# EAGLE schematic board (EAGLE 6.4)
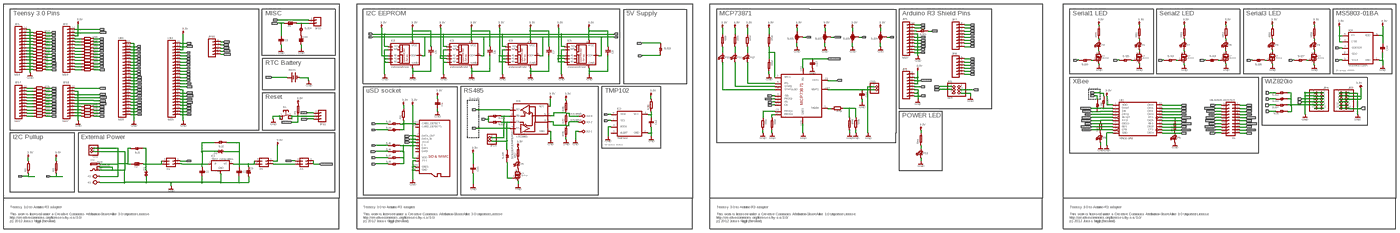
[diagram p0: schematic, sheet 1, overview]
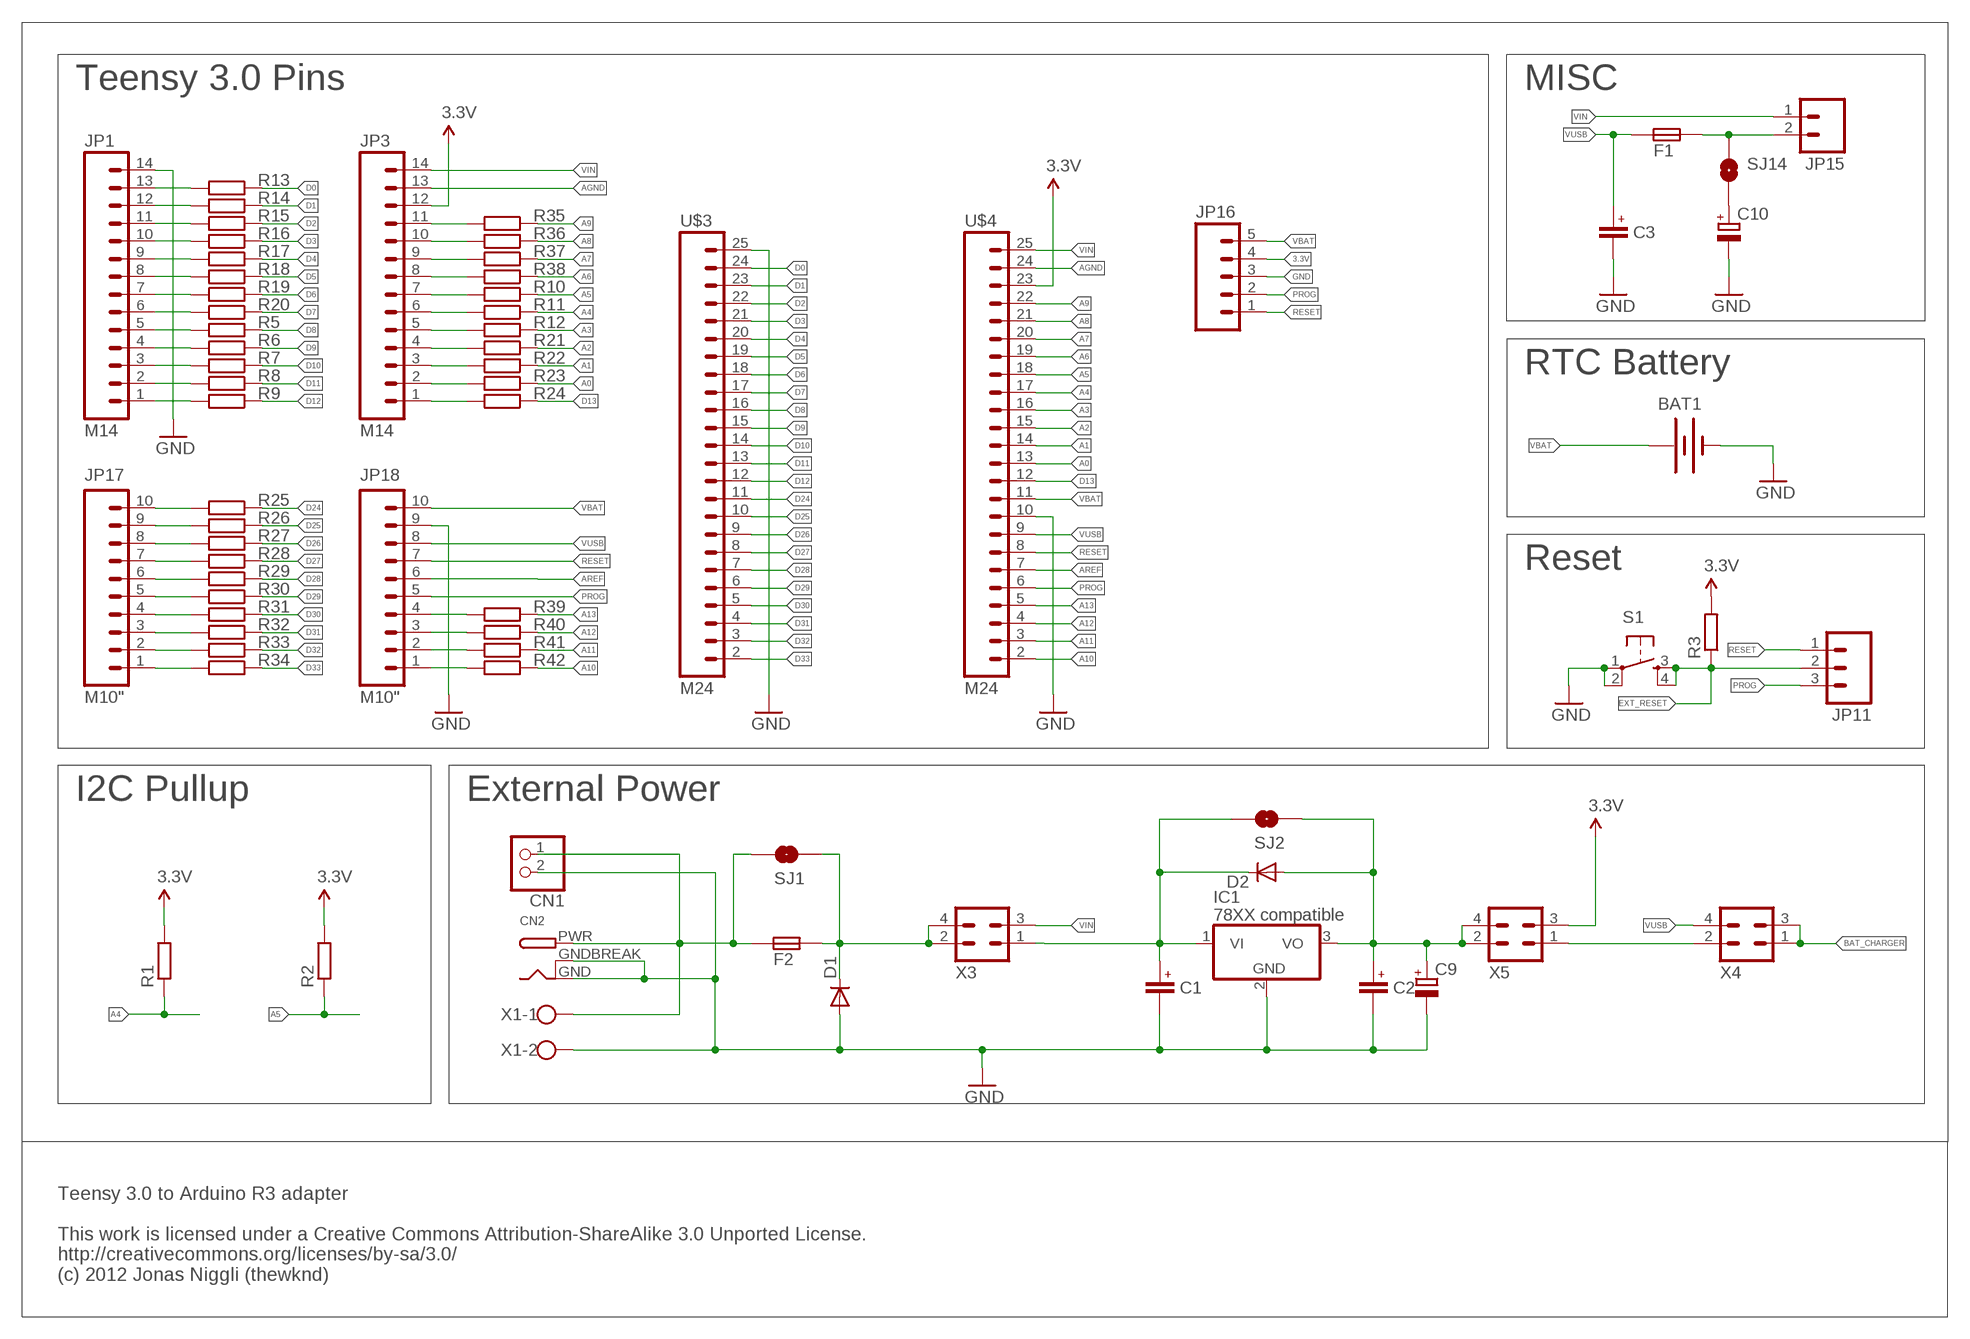
[diagram p1: schematic, sheet 1, part 1 of 4]
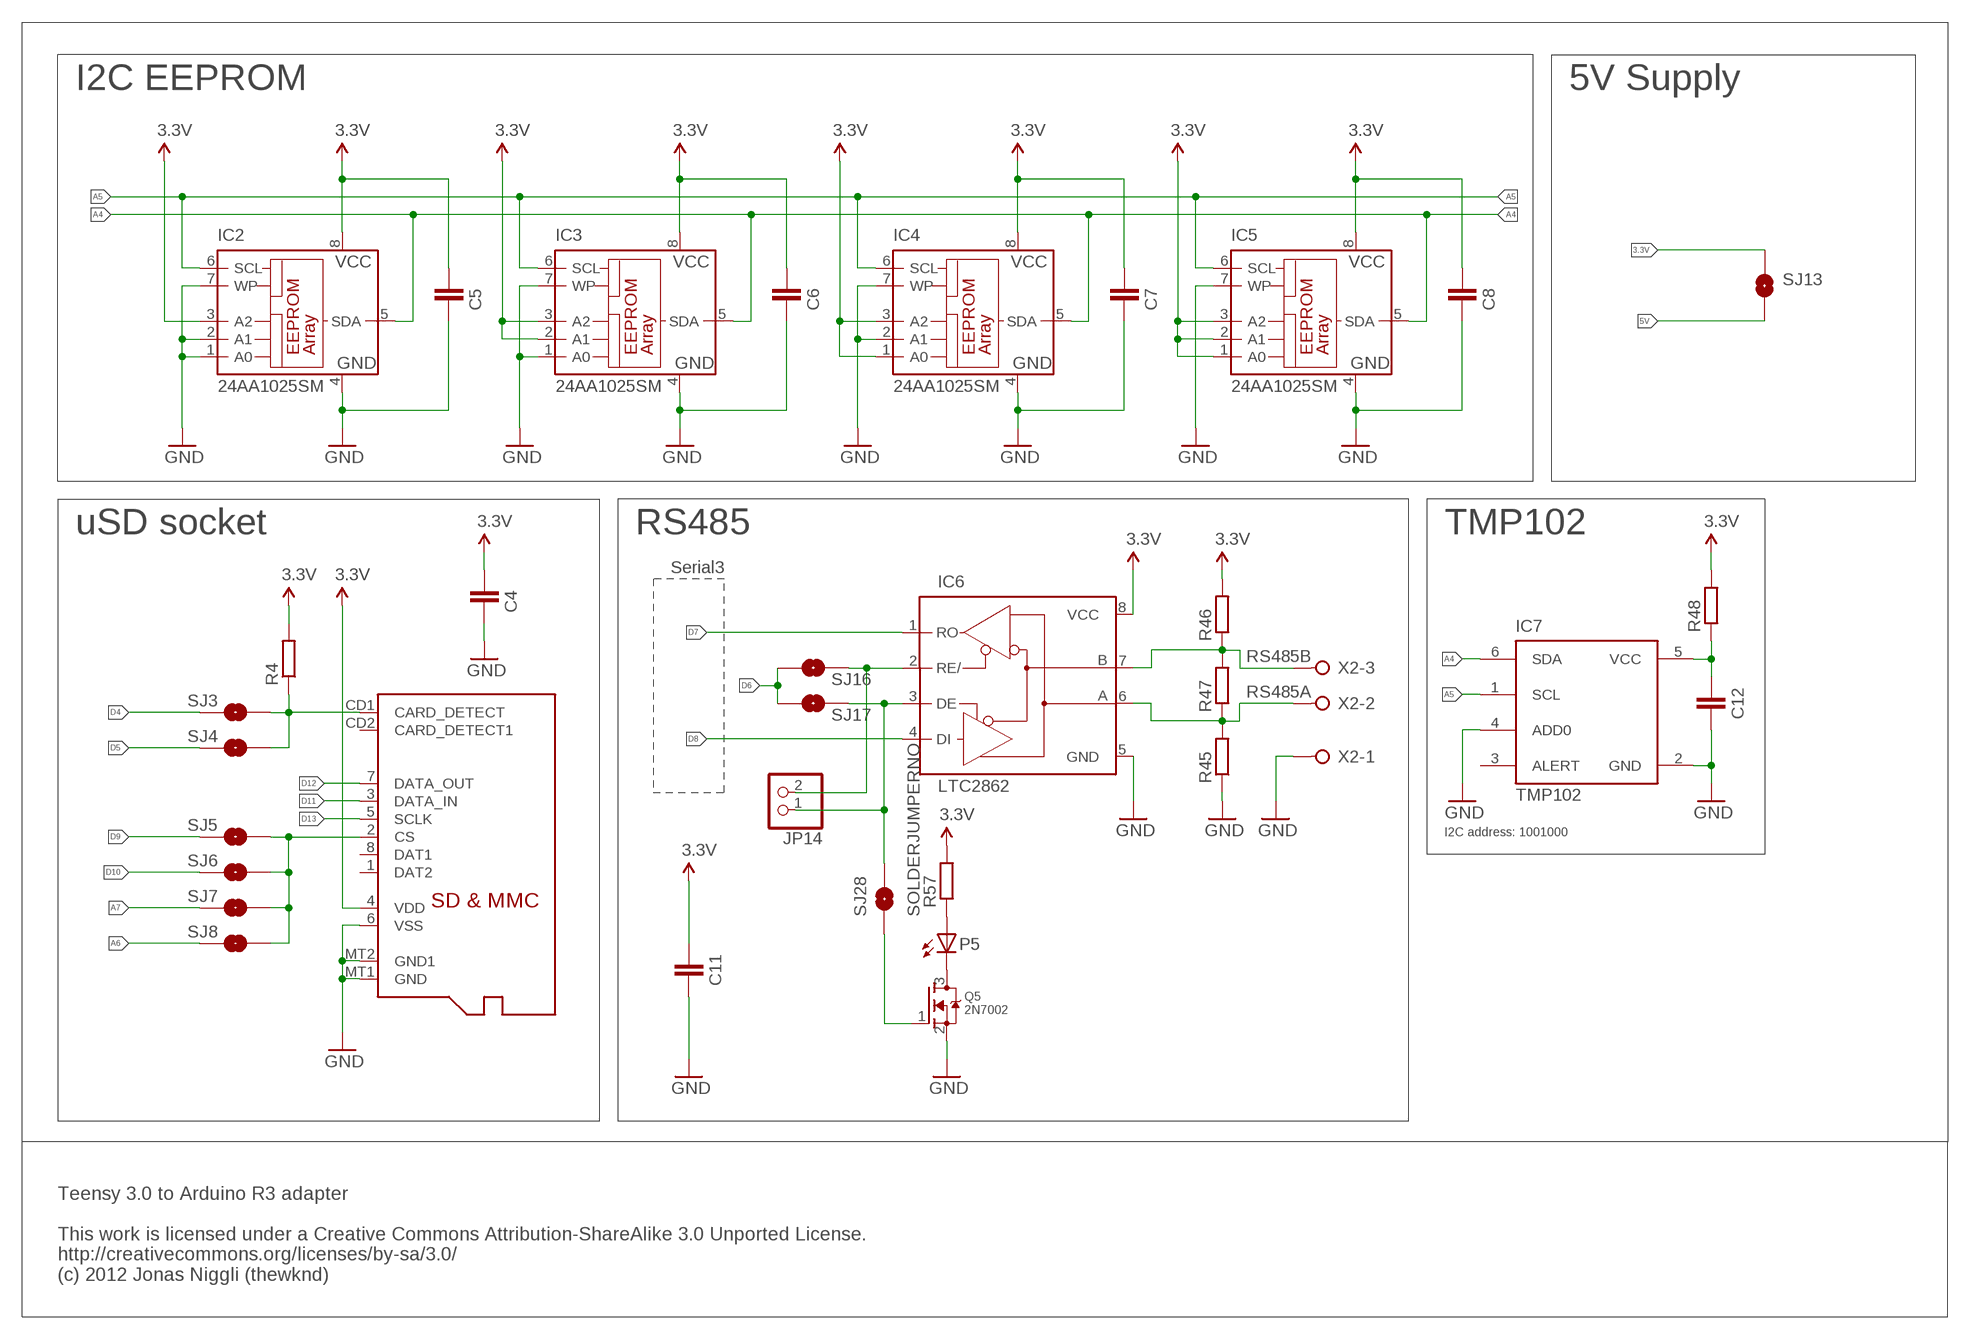
[diagram p2: schematic, sheet 1, part 2 of 4]
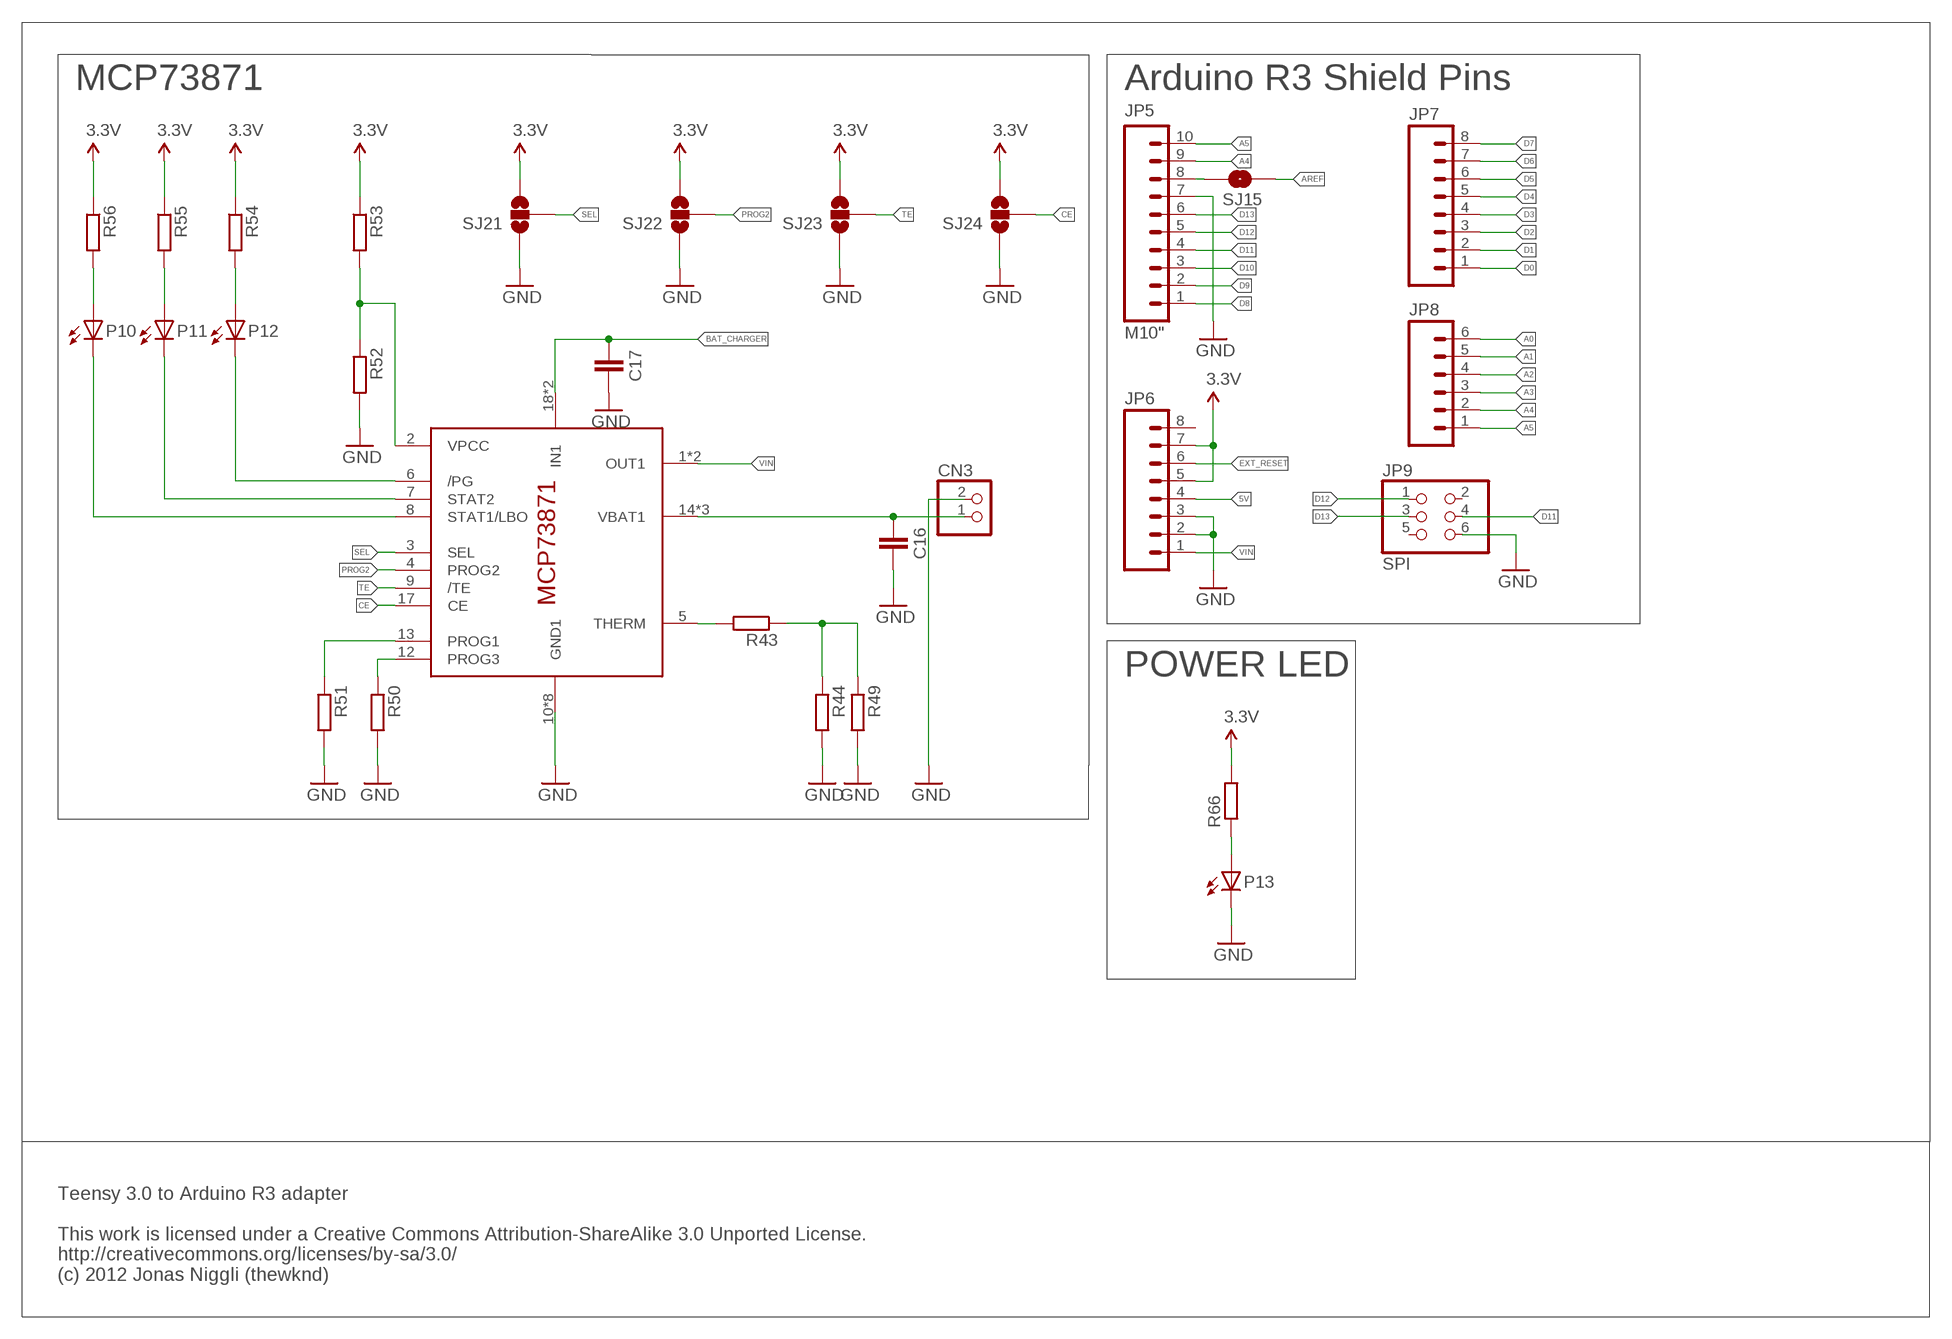
[diagram p3: schematic, sheet 1, part 3 of 4]
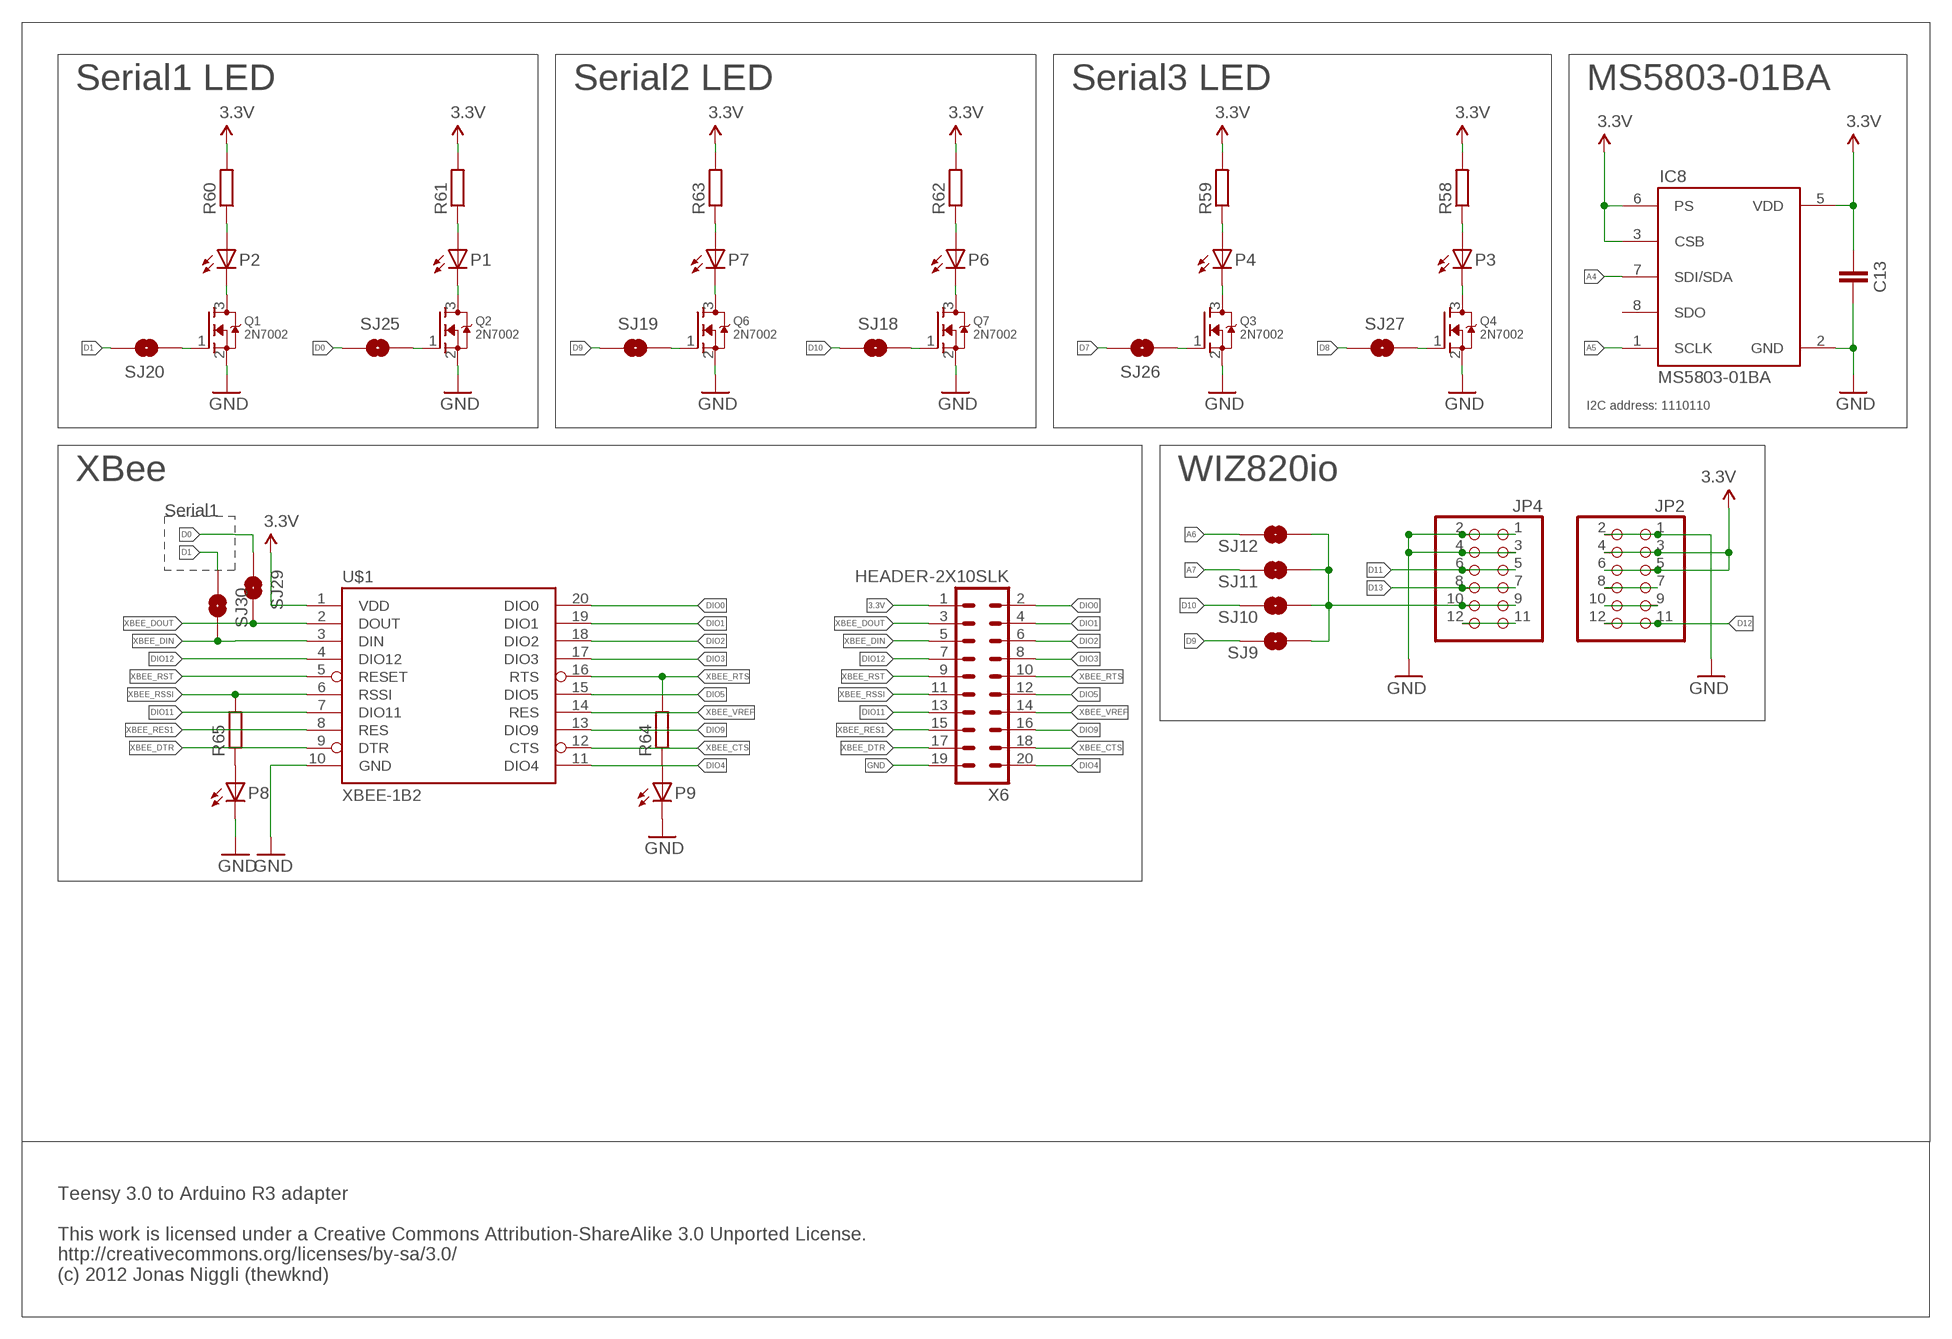
[diagram p4: schematic, sheet 1, part 4 of 4]

## Parts
BAT1  BATTERY12MM  [BATTCON_12MM]
C1  CAPACITOR_POL-3216-POL  [3216C-POL]
C2  CAPACITOR_POL-3216-POL  [3216C-POL]
C3  CAPACITOR_POL-3216-POL  [3216C-POL]
C4  CAPACITOR-0805  [0805C]
C5  CAPACITOR-0805  [0805C]
C6  CAPACITOR-0805  [0805C]
C7  CAPACITOR-0805  [0805C]
C8  CAPACITOR-0805  [0805C]
C9  CPOL-EUD  [PANASONIC_D]
C10  CPOL-EU085CS-1AR  [085CS_1AR]
C11  CAPACITOR-0805  [0805C]
C12  CAPACITOR-0805  [0805C]
C13  CAPACITOR-0805  [0805C]
C16  CAPACITOR-0805  [0805C]
C17  CAPACITOR-0805  [0805C]
CN1  JST_2PIN-THM-RA  [JST-PH-2-THM-RA]
CN2  DCBARRELPTH  [DCJACK_2MM_PTH]
CN3  JST_2PIN-THM-RA  [JST-PH-2-THM-RA]
D1  DIODESMA-KIT  [SMA-DIODE-KIT]
D2  DIODESMA-KIT  [SMA-DIODE-KIT]
F1  FUSE1812  [1812STD]
F2  FUSE1812  [1812STD]
IC1  78XX compatible  7805TV  [TO220V]
IC2  24AA1025SM  EEPROM24AAXXXSM  [SOIC-8]
IC3  24AA1025SM  EEPROM24AAXXXSM  [SOIC-8]
IC4  24AA1025SM  EEPROM24AAXXXSM  [SOIC-8]
IC5  24AA1025SM  EEPROM24AAXXXSM  [SOIC-8]
IC6  LTC2862  MAX3468ESA  [SO08]
IC7  TMP102  [SOT563]
IC8  MS5803-01BA  [MS5803]
IC9  MCP73871  [QFN-20]
JP1  M14  [1X14]
JP2  PINHD-2X6  [2X06]
JP3  M14  [1X14]
JP4  PINHD-2X6  [2X06]
JP5  M10"  [1X10]
JP6  M081X08  [1X08]
JP7  M081X08  [1X08]
JP8  M06SIP  [1X06]
JP9  SPI  PINHD-2X3  [2X03]
JP11  M03PTH  [1X03]
JP14  PINHD-1X2  [1X02]
JP15  M02PTH  [1X02]
JP16  M05PTH  [1X05]
JP17  M10"  [1X10]
JP18  M10"  [1X10]
P1  LED  [LED0805]
P2  LED  [LED0805]
P3  LED  [LED0805]
P4  LED  [LED0805]
P5  LED  [LED0805]
P6  LED  [LED0805]
P7  LED  [LED0805]
P8  LED  [LED0805]
P9  LED  [LED0805]
P10  LED  [LED0805]
P11  LED  [LED0805]
P12  LED  [LED0805]
P13  LED  [LED0805]
Q1  2N7002  MOSFET-NREFLOW  [SOT23]
Q2  2N7002  MOSFET-NREFLOW  [SOT23]
Q3  2N7002  MOSFET-NREFLOW  [SOT23]
Q4  2N7002  MOSFET-NREFLOW  [SOT23]
Q5  2N7002  MOSFET-NREFLOW  [SOT23]
Q6  2N7002  MOSFET-NREFLOW  [SOT23]
Q7  2N7002  MOSFET-NREFLOW  [SOT23]
R1  RESISTOR  [R0805]
R2  RESISTOR  [R0805]
R3  RESISTOR  [R0805]
R4  R4  RESISTOR  [R0805]
R5  RESISTOR  [R0805]
R6  RESISTOR  [R0805]
R7  RESISTOR  [R0805]
R8  RESISTOR  [R0805]
R9  RESISTOR  [R0805]
R10  RESISTOR  [R0805]
R11  RESISTOR  [R0805]
R12  RESISTOR  [R0805]
R13  RESISTOR  [R0805]
R14  RESISTOR  [R0805]
R15  RESISTOR  [R0805]
R16  RESISTOR  [R0805]
R17  RESISTOR  [R0805]
R18  RESISTOR  [R0805]
R19  RESISTOR  [R0805]
R20  RESISTOR  [R0805]
R21  RESISTOR  [R0805]
R22  RESISTOR  [R0805]
R23  RESISTOR  [R0805]
R24  RESISTOR  [R0805]
R25  RESISTOR  [R0805]
R26  RESISTOR  [R0805]
R27  RESISTOR  [R0805]
R28  RESISTOR  [R0805]
R29  RESISTOR  [R0805]
R30  RESISTOR  [R0805]
R31  RESISTOR  [R0805]
R32  RESISTOR  [R0805]
R33  RESISTOR  [R0805]
R34  RESISTOR  [R0805]
R35  RESISTOR  [R0805]
R36  RESISTOR  [R0805]
R37  RESISTOR  [R0805]
R38  RESISTOR  [R0805]
R39  RESISTOR  [R0805]
R40  RESISTOR  [R0805]
R41  RESISTOR  [R0805]
R42  RESISTOR  [R0805]
R43  RESISTOR  [R0805]
R44  RESISTOR  [R0805]
R45  RESISTOR  [R0805]
R46  RESISTOR  [R0805]
R47  RESISTOR  [R0805]
R48  RESISTOR  [R0805]
R49  RESISTOR  [R0805]
R50  RESISTOR  [R0805]
R51  RESISTOR  [R0805]
R52  RESISTOR  [R0805]
R53  RESISTOR  [R0805]
R54  RESISTOR  [R0805]
R55  RESISTOR  [R0805]
R56  RESISTOR  [R0805]
R57  RESISTOR  [R0805]
R58  RESISTOR  [R0805]
R59  RESISTOR  [R0805]
R60  RESISTOR  [R0805]
R61  RESISTOR  [R0805]
R62  RESISTOR  [R0805]
R63  RESISTOR  [R0805]
R64  RESISTOR  [R0805]
R65  RESISTOR  [R0805]
R66  RESISTOR  [R0805]
S1  TAC_SWITCHPTH  [TACTILE-PTH]
SJ1  SOLDERJUMPERNO  [SJ_2S-NO]
SJ2  SOLDERJUMPERNO  [SJ_2S-NO]
SJ3  SOLDERJUMPERNO  [SJ_2S-NO]
SJ4  SOLDERJUMPERNO  [SJ_2S-NO]
SJ5  SOLDERJUMPERNO  [SJ_2S-NO]
SJ6  SOLDERJUMPERNO  [SJ_2S-NO]
SJ7  SOLDERJUMPERNO  [SJ_2S-NO]
SJ8  SOLDERJUMPERNO  [SJ_2S-NO]
SJ9  SOLDERJUMPERNO  [SJ_2S-NO]
SJ10  SOLDERJUMPERNO  [SJ_2S-NO]
SJ11  SOLDERJUMPERNO  [SJ_2S-NO]
SJ12  SOLDERJUMPERNO  [SJ_2S-NO]
SJ13  SOLDERJUMPERNO  [SJ_2S-NO]
SJ14  SOLDERJUMPERNO  [SJ_2S-NO]
SJ15  SOLDERJUMPERNO  [SJ_2S-NO]
SJ16  SOLDERJUMPERNO  [SJ_2S-NO]
SJ17  SOLDERJUMPERNO  [SJ_2S-NO]
SJ18  SOLDERJUMPERNO  [SJ_2S-NO]
SJ19  SOLDERJUMPERNO  [SJ_2S-NO]
SJ20  SOLDERJUMPERNO  [SJ_2S-NO]
SJ21  SOLDERJUMPER_2WAYT  [SJ_2]
SJ22  SOLDERJUMPER_2WAYT  [SJ_2]
SJ23  SOLDERJUMPER_2WAYT  [SJ_2]
SJ24  SOLDERJUMPER_2WAYT  [SJ_2]
SJ25  SOLDERJUMPERNO  [SJ_2S-NO]
SJ26  SOLDERJUMPERNO  [SJ_2S-NO]
SJ27  SOLDERJUMPERNO  [SJ_2S-NO]
SJ28  SOLDERJUMPERNO  [SJ_2S-NO]
SJ29  SOLDERJUMPERNO  [SJ_2S-NO]
SJ30  SOLDERJUMPERNO  [SJ_2S-NO]
U1  MICROSD  [MICROSD]
U$1  XBEE-1B2  [XBEE-SILK]
U$3  M24  [1X24]
U$4  M24  [1X24]
X1  W237-102  [W237-102]
X2  W237-03P  [W237-133]
X3  HEADER-2X2  [HEADER-PTH-2X2]
X4  HEADER-2X2  [HEADER-PTH-2X2]
X5  HEADER-2X2  [HEADER-PTH-2X2]
X6  HEADER-2X10SLK  [HEADER-PTH-2X10]

## Nets
3.3V [POWER]: C4.1 C5.1 C6.1 C7.1 C8.1 C11.1 C13.1 IC2.3(A2) IC2.8(VCC) IC3.2(A1) IC3.3(A2) IC3.8(VCC) IC4.1(A0) IC4.3(A2) IC4.8(VCC) IC5.1(A0) IC5.2(A1) IC5.3(A2) IC5.8(VCC) IC6.8(VCC) IC8.3(CSB) IC8.5(VDD) IC8.6(PS) JP2.3 JP2.4 JP2.5 JP2.6 JP3.12 JP6.5 JP6.7 JP16.4 R1.2 R2.2 R3.2 R4.2 R46.2 R48.2 R53.1 R54.1 R55.1 R56.1 R57.2 R58.2 R59.2 R60.2 R61.2 R62.2 R63.2 R66.2 SJ13.1 SJ21.3 SJ22.3 SJ23.3 SJ24.3 U1.4(VDD) U$1.1(VDD) U$4.23 X5.3 X6.1
5V [POWER]: JP6.4 SJ13.2
/PG: IC9.6(/PG) P12.C
A0: JP8.6 R23.1 U$4.13
A1: JP8.5 R22.1 U$4.14
A2: JP8.4 R21.1 U$4.15
A3: JP8.3 R12.1 U$4.16
A4: IC2.5(SDA) IC3.5(SDA) IC4.5(SDA) IC5.5(SDA) IC7.6(SDA) IC8.7(SDI/SDA) JP5.9 JP8.2 R1.1 R11.1 U$4.17
A5: IC2.6(SCL) IC3.6(SCL) IC4.6(SCL) IC5.6(SCL) IC7.1(SCL) IC8.1(SCLK) JP5.10 JP8.1 R2.1 R10.1 U$4.18
A6: R38.1 SJ8.2 SJ12.2 U$4.19
A7: R37.1 SJ7.2 SJ11.2 U$4.20
A8: R36.1 U$4.21
A9: R35.1 U$4.22
A10: R42.1 U$4.2
A11: R41.1 U$4.3
A12: R40.1 U$4.4
A13: R39.1 U$4.5
AGND [POWER]: JP3.13 U$4.24
AREF: JP18.6 SJ15.2 U$4.7
BAT_CHARGER [POWER]: C17.1 IC9.18(IN1) IC9.19(IN1) X4.1 X4.3
CE: IC9.17(CE) SJ24.2
D0: JP7.1 R13.1 SJ25.1 SJ29.1 U$3.24
D1: JP7.2 R14.1 SJ20.2 SJ30.1 U$3.23
D2: JP7.3 R15.1 U$3.22
D3: JP7.4 R16.1 U$3.21
D4: JP7.5 R17.1 SJ3.2 U$3.20
D5: JP7.6 R18.1 SJ4.2 U$3.19
D6: JP7.7 R19.1 SJ16.1 SJ17.1 U$3.18
D7: IC6.1(RO) JP7.8 R20.1 SJ26.2 U$3.17
D8: IC6.4(DI) JP5.1 R5.1 SJ27.1 U$3.16
D9: JP5.2 R6.1 SJ5.2 SJ9.2 SJ19.1 U$3.15
D10: JP5.3 R7.1 SJ6.2 SJ10.2 SJ18.1 U$3.14
D11: JP4.5 JP4.6 JP5.4 JP9.4 R8.1 U1.3(DATA_IN) U$3.13
D12: JP2.11 JP2.12 JP5.5 JP9.1 R9.1 U1.7(DATA_OUT) U$3.12
D13: JP4.7 JP4.8 JP5.6 JP9.3 R24.1 U1.5(SCLK) U$4.12
D24: R25.1 U$3.11
D25: R26.1 U$3.10
D26: R27.1 U$3.9
D27: R28.1 U$3.8
D28: R29.1 U$3.7
D29: R30.1 U$3.6
D30: R31.1 U$3.5
D31: R32.1 U$3.4
D32: R33.1 U$3.3
D33: R34.1 U$3.2
DIO0: U$1.20(DIO0) X6.2
DIO1: U$1.19(DIO1) X6.4
DIO2: U$1.18(DIO2) X6.6
DIO3: U$1.17(DIO3) X6.8
DIO4: U$1.11(DIO4) X6.20
DIO5: U$1.15(DIO5) X6.12
DIO9: U$1.13(DIO9) X6.16
DIO11: U$1.7(DIO11) X6.13
DIO12: U$1.4(DIO12) X6.7
EXT_POWER [POWER]: CN1.1 CN2.PWR F2.+ SJ1.2 X1.1
EXT_RESET: JP6.6 JP11.2 R3.1 S1.3 S1.4
GND [POWER]: BAT1.GND(-) C1.- C2.- C3.- C4.2 C5.2 C6.2 C7.2 C8.2 C9.- C10.- C11.2 C12.2 C13.2 C16.2 C17.2 CN1.2 CN2.GND CN2.GNDBREAK CN3.2 D1.A IC1.2(GND) IC2.1(A0) IC2.2(A1) IC2.4(GND) IC2.7(WP) IC3.1(A0) IC3.4(GND) IC3.7(WP) IC4.2(A1) IC4.4(GND) IC4.7(WP) IC5.4(GND) IC5.7(WP) IC6.5(GND) IC7.2(GND) IC7.4(ADD0) IC8.2(GND) IC9.10(GND1) IC9.11(GND1) IC9.21(GND1) IC9.22(GND1) IC9.P$1(GND1) IC9.P$2(GND1) IC9.P$3(GND1) IC9.P$4(GND1) JP1.14 JP2.1 JP2.2 JP4.1 JP4.2 JP4.3 JP4.4 JP5.7 JP6.2 JP6.3 JP9.6 JP16.3 JP18.9 P8.C P9.C P13.C Q1.2(S) Q2.2(S) Q3.2(S) Q4.2(S) Q5.2(S) Q6.2(S) Q7.2(S) R44.2 R45.1 R49.2 R50.2 R51.2 R52.2 S1.1 S1.2 SJ21.1 SJ22.1 SJ23.1 SJ24.1 U1.6(VSS) U1.MT1(GND) U1.MT2(GND1) U$1.10(GND) U$3.25 U$4.10 X1.2 X2.1 X6.19
N$1 [POWER]: D1.C F2.- SJ1.1 X3.2 X3.4
N$2 [POWER]: F1.- JP15.2 SJ14.1
N$3 [POWER]: C1.+ D2.C IC1.1(VI) SJ2.2 X3.1
N$5: JP1.5 R5.2
N$6: JP1.4 R6.2
N$7: JP1.3 R7.2
N$8: JP1.2 R8.2
N$9: JP1.1 R9.2
N$10: JP3.7 R10.2
N$11: JP3.6 R11.2
N$12: JP3.5 R12.2
N$13: JP1.13 R13.2
N$14: JP1.12 R14.2
N$15: JP1.11 R15.2
N$16: JP1.10 R16.2
N$17: JP1.9 R17.2
N$18: JP1.8 R18.2
N$19: JP1.7 R19.2
N$20: JP1.6 R20.2
N$21: JP3.4 R21.2
N$22: JP3.3 R22.2
N$23: JP3.2 R23.2
N$24: JP3.1 R24.2
N$25: JP17.10 R25.2
N$26: JP17.9 R26.2
N$27: JP17.8 R27.2
N$28: JP17.7 R28.2
N$29: JP17.6 R29.2
N$30: JP17.5 R30.2
N$31: JP17.4 R31.2
N$32: JP17.3 R32.2
N$33: JP17.2 R33.2
N$34: JP17.1 R34.2
N$35: JP3.11 R35.2
N$36: JP3.10 R36.2
N$37: JP3.9 R37.2
N$38: JP3.8 R38.2
N$39: JP18.4 R39.2
N$40: JP18.3 R40.2
N$41: JP18.2 R41.2
N$42: JP18.1 R42.2
N$43: IC6.2(RE/) JP14.2 SJ16.2
N$44: IC6.3(DE) JP14.1 SJ17.2 SJ28.2
N$45: P5.C Q5.3(D)
N$46: P5.A R57.1
N$47 [POWER]: P4.A R59.1
N$48 [POWER]: P3.A R58.1
N$49: P3.C Q4.3(D)
N$50: P4.C Q3.3(D)
N$51 [POWER]: P1.A R61.1
N$52: JP4.9 JP4.10 SJ9.1 SJ10.1 SJ11.1 SJ12.1
N$53: JP4.11 JP4.12
N$54 [POWER]: P2.A R60.1
N$55: P1.C Q2.3(D)
N$56: P2.C Q1.3(D)
N$57: JP2.7 JP2.8
N$58: JP2.9 JP2.10
N$59 [POWER]: P7.A R63.1
N$60 [POWER]: P6.A R62.1
N$61: P6.C Q7.3(D)
N$62: P7.C Q6.3(D)
N$63: JP5.8 SJ15.1
N$64: Q7.1(G) SJ18.2
N$65 [POWER]: C10.+ SJ14.2
N$66: Q6.1(G) SJ19.2
N$67: Q1.1(G) SJ20.1
N$68: Q2.1(G) SJ25.2
N$69: Q5.1(G) SJ28.1
N$70: Q3.1(G) SJ26.1
N$71: Q4.1(G) SJ27.2
N$72: P8.A R65.1
N$73: P9.A R64.1
N$74 [POWER]: P13.A R66.1
N$100 [POWER]: C16.1 CN3.1 IC9.14(VBAT1) IC9.15(VBAT1) IC9.16(VBAT1)
N$103: R43.1 R44.1 R49.1
N$104: IC9.5(THERM) R43.2
N$105: IC9.12(PROG3) R50.1
N$106: IC9.13(PROG1) R51.1
N$107: IC9.2(VPCC) R52.1 R53.2
N$109 [POWER]: C2.+ C9.+ D2.A IC1.3(VO) SJ2.1 X5.2 X5.4
N$110 [POWER]: X4.2 X5.1
N$111: P12.A R54.2
N$112: P11.A R55.2
N$113: P10.A R56.2
NIC: R4.1 SJ3.1 SJ4.1 U1.CD1(CARD_DETECT)
PROG: JP11.3 JP16.2 JP18.5 U$4.6
PROG2: IC9.4(PROG2) SJ22.2
QW: SJ5.1 SJ6.1 SJ7.1 SJ8.1 U1.2(CS)
RESET: JP11.1 JP16.1 JP18.7 U$4.8
RS485A: IC6.6(A) R45.2 R47.1 X2.2
RS485B: IC6.7(B) R46.1 R47.2 X2.3
SEL: IC9.3(SEL) SJ21.2
STAT1: IC9.8(STAT1/LBO) P10.C
STAT2: IC9.7(STAT2) P11.C
TE: IC9.9(/TE) SJ23.2
VBAT: BAT1.PWR@1(+) JP16.5 JP18.10 U$4.11
VCC [POWER]: C12.1 IC7.5(VCC) R48.1
VIN [POWER2]: IC9.1(OUT1) IC9.20(OUT1) JP3.14 JP6.1 JP15.1 U$4.25 X3.3
VUSB [POWER]: C3.+ F1.+ JP18.8 U$4.9 X4.4
XBEE_CTS: U$1.12(CTS) X6.18
XBEE_DIN: SJ30.2 U$1.3(DIN) X6.5
XBEE_DOUT: SJ29.2 U$1.2(DOUT) X6.3
XBEE_DTR: U$1.9(DTR) X6.17
XBEE_RES1: U$1.8(RES) X6.15
XBEE_RSSI: R65.2 U$1.6(RSSI) X6.11
XBEE_RST: U$1.5(RESET) X6.9
XBEE_RTS: R64.2 U$1.16(RTS) X6.10
XBEE_VREF: U$1.14(RES) X6.14
Unconnected: IC7.3(ALERT) IC8.8(SDO) JP6.8 JP9.2 JP9.5 U1.1(DAT2) U1.8(DAT1) U1.CD2(CARD_DETECT1)

## Notes on the sheet
- Teensy 3.0 Pins | MISC | I2C EEPROM | 5V Supply | MCP73871 | Arduino R3 Shield Pins | Serial1 LED | Serial2 LED | Serial3 LED | MS5803-01BA
- RTC Battery
- I2C address: 1110110
- XBee | WIZ820io
- Serial1
- uSD socket | RS485 | TMP102
- Serial3
- Reset
- RS485B
- POWER LED
- RS485A
- I2C Pullup | External Power
- I2C address: 1001000
- Teensy 3.0 to Arduino R3 adapter
  
  This work is licensed under a Creative Commons Attribution-ShareAlike 3.0 Unported License.
  http://creativecommons.org/licenses/by-sa/3.0/
  (c) 2012 Jonas Niggli (thewknd)
- Teensy 3.0 to Arduino R3 adapter
  
  This work is licensed under a Creative Commons Attribution-ShareAlike 3.0 Unported License.
  http://creativecommons.org/licenses/by-sa/3.0/
  (c) 2012 Jonas Niggli (thewknd)
- Teensy 3.0 to Arduino R3 adapter
  
  This work is licensed under a Creative Commons Attribution-ShareAlike 3.0 Unported License.
  http://creativecommons.org/licenses/by-sa/3.0/
  (c) 2012 Jonas Niggli (thewknd)
- Teensy 3.0 to Arduino R3 adapter
  
  This work is licensed under a Creative Commons Attribution-ShareAlike 3.0 Unported License.
  http://creativecommons.org/licenses/by-sa/3.0/
  (c) 2012 Jonas Niggli (thewknd)

## Library data of the parts
BAT1 = SparkFun-Electromechanical:BATTERY: Battery Holders Various common sizes : AA, AAA, 20mm coin cell and 12mm coin cell. 20MM_4LEGS, BATT-10373
C1-C3 = thewknd:CAPACITOR_POL
C4-C8 C11-C13 C16 C17 = thewknd:CAPACITOR
C9 = resistor:CPOL-EU: POLARIZED CAPACITOR, European symbol
C10 = rcl:CPOL-EU: POLARIZED CAPACITOR, European symbol
CN1 CN3 = adafruit:JST_2PIN: JST 2-Pin Connectors of various flavors SMT-RA (S2B-PH-SM4) 4UConnector #17311 SMT (B2B-PH-SM4) THM-RA (S2B-PH) THM (B2B-PH)
CN2 = adafruit:DCBARREL: 2.0mm DC Barrel Jack DCJACK_2MM_PTH - Through Hole Jack (4UConnector: 05537)
D1 D2 = SparkFun-DiscreteSemi:DIODE: Diode These are standard reverse protection diodes and small signal diodes. SMA package can handle up to about 1A. SOD-323 can handle about 200mA. What the SOD-323 package when ordering, there are some mfgs out there that are 5-pin packages.
F1 F2 = thewknd:FUSE
IC1 = linear:78*: Positive VOLTAGE REGULATOR Source: http://cache.national.com/ds/LM/LM78L05.pdf http://www.fairchildsemi.com/ds/LM/LM7805.pdf
IC2-IC5 = thewknd:EEPROM
IC6 = maxim:MAX34*: +5V, Fail-Safe, 40Mbps, Profibus RS-485/RS-422 Transceivers Source: MAX3465-MAX3469.pdf; MPN: MAX3468ESA+T; OC_FARNELL: unknown; OC_NEWARK: 76K6724
IC7 = thewknd:TMP102: The TMP102 is a two-wire, serial output temperature sensor available in a tiny SOT563 package. Requiring no external components, the TMP102 is capable of reading temperatures to a resolution of 0.0625°C.
IC8 = thewknd:MS5803: MS5803 Miniature Variometer Module Ordering Information Product: Code MS5803-01BA Product: Miniature Variometer Module Art. No: MS580301BA01-00
IC9 = thewknd:MCP73871: The MCP73871 device is a fully integrated linear solution for system load sharing and Li-Ion / Li-Polymer battery charge management with ac-dc wall adapter and USB port power sources selection. It’s also capable of autonomous power source selection between input or battery. Along with its small physical size, the low number of required external components makes the device ideally suited for portable applications. http://www.microchip.com/wwwproducts/Devices.aspx?dDocName=en536670
JP1 JP3 = SparkFun-Connectors:M14: Header 14 Standard 14-pin 0.1" header. Use with straight break away headers (SKU : PRT-00116), right angle break away headers (PRT-00553), swiss pins (PRT-00743), machine pins (PRT-00117), and female headers (PRT-00115).
JP2 JP4 = pinhead:PINHD-2X6: PIN HEADER
JP5 JP17 JP18 = SparkFun-Connectors:M10: Header 10 Standard 10-pin 0.1" header. Use with straight break away headers (SKU : PRT-00116), right angle break away headers (PRT-00553), swiss pins (PRT-00743), machine pins (PRT-00117), and female headers (PRT-00115).
JP6 JP7 = SparkFun-Connectors:M08: Header 8 Standard 8-pin 0.1" header. Use with straight break away headers (SKU : PRT-00116), right angle break away headers (PRT-00553), swiss pins (PRT-00743), machine pins (PRT-00117), and female headers (PRT-00115).
JP8 = SparkFun-Connectors:M06: Header 6 Standard 6-pin 0.1" header. Use with straight break away headers (SKU : PRT-00116), right angle break away headers (PRT-00553), swiss pins (PRT-00743), machine pins (PRT-00117), and female headers (PRT-00115). Molex polarized connector foot print use with SKU : PRT-08094 with associated crimp pins and housings. NOTES ON THE VARIANTS LOCK and LOCK_LONGPADS... This footprint was designed to help hold the alignment of a through-hole component (i.e. 6-pin header) while soldering it into place. You may notice that each hole has been shifted either up or down by 0.005 of an inch from it's more standard position (which is a perfectly straight line). This slight alteration caused the pins (the squares in the middle) to touch the edges of the holes. Because they are alternating, it causes a "brace" to hold the component in place. 0.005 has proven to be the perfect amount of "off-center" position when using our standard breakaway headers. Although looks a little odd when you look at the bare footprint, once you have a header in there, the alteration is very hard to notice. Also, if you push a header all the way into place, it is covered up entirely on the bottom side. This idea of altering the position of holes to aid alignment will be further integrated into the Sparkfun Library for other footprints. It can help hold any component with 3 or more connection pins.
JP9 = SparkFun-Connectors:PINHD-2X3: PIN HEADER
JP11 = SparkFun-Connectors:M03: Header 3 Standard 3-pin 0.1" header. Use with straight break away headers (SKU : PRT-00116), right angle break away headers (PRT-00553), swiss pins (PRT-00743), machine pins (PRT-00117), and female headers (PRT-00115). Molex polarized connector foot print use with SKU : PRT-08232 with associated crimp pins and housings.
JP14 = pinhead:PINHD-1X2: PIN HEADER
JP15 = SparkFun-Connectors:M02: Header 2 Standard 2-pin 0.1" header. Use with straight break away headers (SKU : PRT-00116), right angle break away headers (PRT-00553), swiss pins (PRT-00743), machine pins (PRT-00117), and female headers (PRT-00115). Molex polarized connector foot print use with SKU : PRT-08233 with associated crimp pins and housings.
JP16 = SparkFun-Connectors:M05: Header 5 Standard 5-pin 0.1" header. Use with straight break away headers (SKU : PRT-00116), right angle break away headers (PRT-00553), swiss pins (PRT-00743), machine pins (PRT-00117), and female headers (PRT-00115). Molex polarized connector foot print use with SKU : PRT-08230 with associated crimp pins and housings.
P1-P13 = thewknd:LED
Q1-Q7 = adafruit:MOSFET-N: N-Channel Mosfet 2N7002E - 60V 260mA SOT23 [Digikey: 2N7002ET1GOSTR-ND] - REEL BSH103 - 30V 850mA SOT23 [Digikey: 568-5013-1-ND]
R1-R66 = thewknd:RESISTOR
S1 = SparkFun-Electromechanical:TAC_SWITCH: Momentary Switch Button commonly used for reset or general input. Spark Fun Electronics SKU : COM-00097 SMT- SWCH-08247
SJ1-SJ20 SJ25-SJ30 = SparkFun-Passives:SOLDERJUMPER: Solder Jumper Standard SMD solder jumper. Used to automate production. Two varients : Normally Open and Normally Closed are the same, but have different paste layers. NC will have a large amount of paste and should jumper during reflow.
SJ21-SJ24 = SparkFun-Passives:SOLDERJUMPER_2WAY: Solder Jumper 2 way solder jumper
U1 = adafruit:MICROSD: Micro-SD / Transflash card holder with SPI pinout For the 3M # 2908-05WB-MG and/or 4UCON #19656 push-push type
U$1 = SparkFun-RF:XBEE-1: Xbee module footprints SMT header is CONN-09042.
U$3 U$4 = SparkFun-Connectors:M24: 1x24 .1" header
X1 = con-wago-500:W237-102: WAGO SCREW CLAMP; MPN: 237-102; OC_FARNELL: unknown; OC_NEWARK: 70K9898
X2 = con-wago-508:W237-03P: WAGO SREW CLAMP; OC_FARNELL: unknown; OC_NEWARK: unknown
X3-X5 = thewknd:HEADER-2X2
X6 = thewknd:HEADER-2X10

## Net classes
0 default: width 0.203 mm, drill 0.33 mm, clearance 0.229 mm
1 POWER: width 0.203 mm, drill 0.33 mm, clearance 0.229 mm
2 POWER2: width 0.254 mm, drill 0.305 mm, clearance 0.229 mm